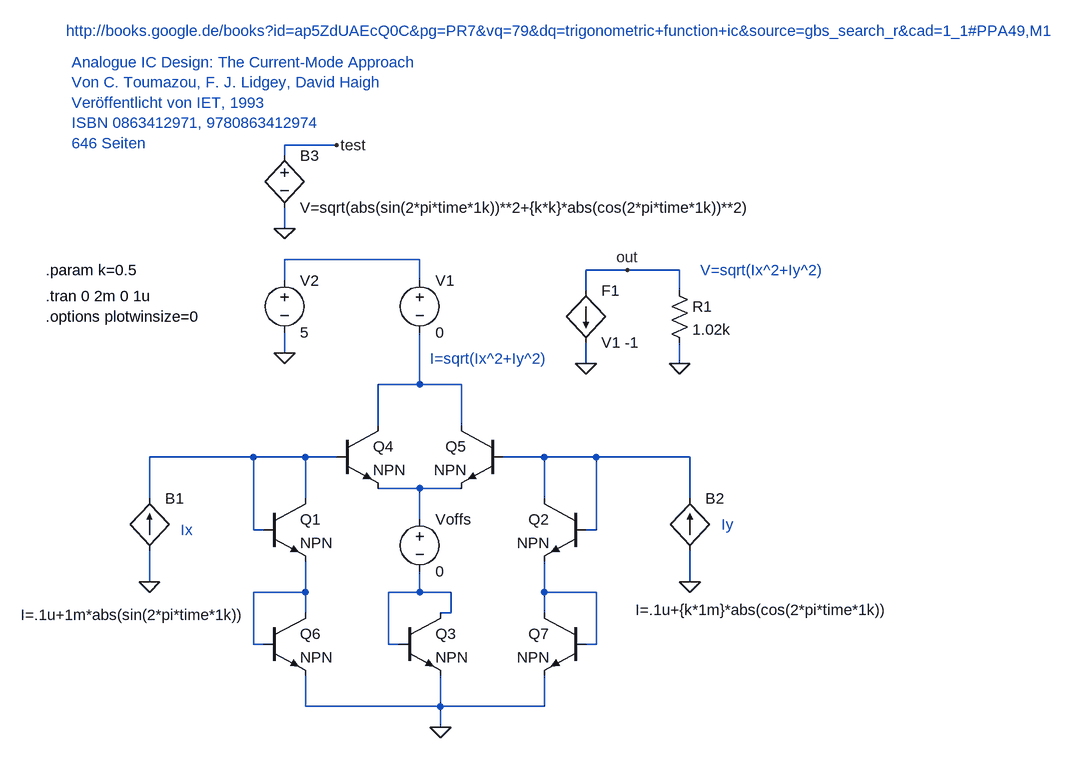
[diagram p0: schematic vector_magnitude1.asc]
vector_magnitude1.asc, the LTspice schematic file:
Version 4
SHEET 1 2004 680
WIRE 176 -416 96 -416
WIRE 96 -400 96 -416
WIRE 96 -288 96 -320
WIRE 304 -240 96 -240
WIRE 624 -224 560 -224
WIRE 704 -224 624 -224
WIRE 96 -208 96 -240
WIRE 304 -208 304 -240
WIRE 560 -192 560 -224
WIRE 704 -192 704 -224
WIRE 96 -96 96 -128
WIRE 560 -80 560 -112
WIRE 704 -80 704 -112
WIRE 304 -48 304 -128
WIRE 304 -48 240 -48
WIRE 368 -48 304 -48
WIRE 240 16 240 -48
WIRE 368 16 368 -48
WIRE 48 64 -112 64
WIRE 128 64 48 64
WIRE 176 64 128 64
WIRE 496 64 432 64
WIRE 576 64 496 64
WIRE 720 64 576 64
WIRE 304 112 240 112
WIRE 368 112 304 112
WIRE -112 128 -112 64
WIRE 128 128 128 64
WIRE 496 128 496 64
WIRE 720 128 720 64
WIRE 304 160 304 112
WIRE 48 176 48 64
WIRE 64 176 48 176
WIRE 576 176 576 64
WIRE 576 176 560 176
WIRE -112 256 -112 208
WIRE 720 256 720 208
WIRE 128 272 128 224
WIRE 128 272 48 272
WIRE 304 272 304 240
WIRE 304 272 256 272
WIRE 352 272 304 272
WIRE 496 272 496 224
WIRE 576 272 496 272
WIRE 128 304 128 272
WIRE 352 304 352 272
WIRE 352 304 336 304
WIRE 496 304 496 272
WIRE 48 352 48 272
WIRE 64 352 48 352
WIRE 256 352 256 272
WIRE 272 352 256 352
WIRE 576 352 576 272
WIRE 576 352 560 352
WIRE 128 448 128 400
WIRE 336 448 336 400
WIRE 336 448 128 448
WIRE 496 448 496 400
WIRE 496 448 336 448
WIRE 336 480 336 448
FLAG 336 480 0
FLAG 720 256 0
FLAG -112 256 0
FLAG 560 -80 0
FLAG 704 -80 0
FLAG 96 -96 0
FLAG 96 -288 0
FLAG 176 -416 test
FLAG 624 -224 out
SYMBOL npn 64 128 R0
SYMATTR InstName Q1
SYMBOL npn 560 128 M0
SYMATTR InstName Q2
SYMBOL npn 272 304 R0
SYMATTR InstName Q3
SYMBOL npn 176 16 R0
SYMATTR InstName Q4
SYMBOL npn 432 16 M0
SYMATTR InstName Q5
SYMBOL npn 64 304 R0
SYMATTR InstName Q6
SYMBOL npn 560 304 M0
SYMATTR InstName Q7
SYMBOL bi2 -112 128 R0
WINDOW 3 -198 179 Left 0
SYMATTR InstName B1
SYMATTR Value I=.1u+1m*abs(sin(2*pi*time*1k))
SYMBOL bi2 720 128 R0
WINDOW 3 -84 171 Left 0
SYMATTR InstName B2
SYMATTR Value I=.1u+{k*1m}*abs(cos(2*pi*time*1k))
SYMBOL f 560 -192 R0
SYMATTR InstName F1
SYMATTR Value V1 -1
SYMBOL voltage 304 -224 R0
SYMATTR InstName V1
SYMATTR Value 0
SYMBOL res 688 -208 R0
SYMATTR InstName R1
SYMATTR Value 1.02k
SYMBOL voltage 96 -224 R0
SYMATTR InstName V2
SYMATTR Value 5
SYMBOL bv 96 -416 R0
SYMATTR InstName B3
SYMATTR Value V=sqrt(abs(sin(2*pi*time*1k))**2+{k*k}*abs(cos(2*pi*time*1k))**2)
SYMBOL voltage 304 144 R0
SYMATTR InstName Voffs
SYMATTR Value 0
TEXT -272 -184 Left 0 !.tran 0 2m 0 1u
TEXT -272 -152 Left 0 !.options plotwinsize=0
TEXT -272 -224 Left 0 !.param k=0.5
TEXT 320 -88 Left 0 ;I=sqrt(Ix^2+Iy^2)
TEXT -64 176 Left 0 ;Ix
TEXT 768 168 Left 0 ;Iy
TEXT -232 -544 Left 0 ;Analogue IC Design: The Current-Mode Approach\nVon C. Toumazou, F. J. Lidgey, David Haigh\nVeröffentlicht von IET, 1993\nISBN 0863412971, 9780863412974\n646 Seiten
TEXT -240 -592 Left 0 ;http://books.google.de/books?id=ap5ZdUAEcQ0C&pg=PR7&vq=79&dq=trigonometric+function+ic&source=gbs_search_r&cad=1_1#PPA49,M1
TEXT 736 -224 Left 0 ;V=sqrt(Ix^2+Iy^2)

The netlist it stands for:
* vector_magnitude1.asc
Q1 N003 N003 N006 0 NPN
Q2 N004 N004 N008 0 NPN
Q3 N007 N007 0 0 NPN
Q4 N002 N003 N005 0 NPN
Q5 N002 N004 N005 0 NPN
Q6 N006 N006 0 0 NPN
Q7 N008 N008 0 0 NPN
B1 0 N003 I=.1u+1m*abs(sin(2*pi*time*1k))
B2 0 N004 I=.1u+{k*1m}*abs(cos(2*pi*time*1k))
F1 out 0 V1 -1
V1 N001 N002 0
R1 out 0 1.02k
V2 N001 0 5
B3 test 0 V=sqrt(abs(sin(2*pi*time*1k))**2+{k*k}*abs(cos(2*pi*time*1k))**2)
Voffs N005 N007 0
.model NPN NPN
.model PNP PNP
.lib standard.bjt
.tran 0 2m 0 1u
.options plotwinsize=0
.param k=0.5
* I=sqrt(Ix^2+Iy^2)
* Ix
* Iy
* Analogue IC Design: The Current-Mode Approach
* Von C. Toumazou, F. J. Lidgey, David Haigh
* Veröffentlicht von IET, 1993
* ISBN 0863412971, 9780863412974
* 646 Seiten
* http://books.google.de/books?id=ap5ZdUAEcQ0C&pg=PR7&vq=79&dq=trigonometric+function+ic&source=gbs_search_r&cad=1_1#PPA49,M1
* V=sqrt(Ix^2+Iy^2)
.backanno
.end